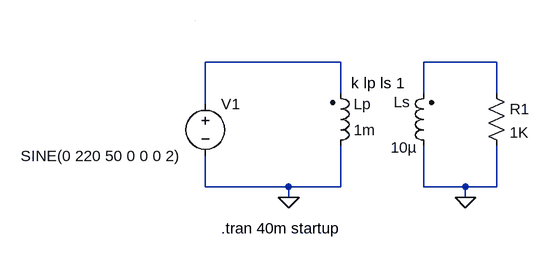
[diagram p0: schematic Transformer.asc]
Transformer.asc, the LTspice schematic file:
Version 4
SHEET 1 880 680
WIRE 224 64 16 64
WIRE 464 64 352 64
WIRE 224 112 224 64
WIRE 352 112 352 64
WIRE 464 112 464 64
WIRE 16 128 16 64
WIRE 16 256 16 208
WIRE 144 256 16 256
WIRE 224 256 224 192
WIRE 224 256 144 256
WIRE 352 256 352 192
WIRE 416 256 352 256
WIRE 464 256 464 192
WIRE 464 256 416 256
WIRE 144 272 144 256
WIRE 416 272 416 256
WIRE 0 0 0 0
FLAG 144 272 0
FLAG 416 272 0
SYMBOL voltage 16 112 R0
WINDOW 3 -284 96 Left 2
WINDOW 123 0 0 Left 0
WINDOW 39 0 0 Left 0
SYMATTR InstName V1
SYMATTR Value SINE(0 220 50 0 0 0 2)
SYMBOL res 448 96 R0
SYMATTR InstName R1
SYMATTR Value 1K
SYMBOL ind2 368 208 R180
WINDOW 0 37 83 Left 2
WINDOW 3 26 13 Left 2
SYMATTR InstName Ls
SYMATTR Value 10µ
SYMATTR Type ind
SYMATTR SpiceLine Rser=1m
SYMBOL ind2 208 208 M180
WINDOW 0 36 80 Left 2
WINDOW 3 36 40 Left 2
SYMATTR InstName Lp
SYMATTR Value 1m
SYMATTR Type ind
SYMATTR SpiceLine Rser=1m
TEXT 40 320 Left 2 !.tran 40m startup
TEXT 240 96 Left 2 !k lp ls 1

The netlist it stands for:
* Transformer.asc
V1 N001 0 SINE(0 220 50 0 0 0 2)
R1 N002 0 1K
Ls 0 N002 10µ Rser=1m
Lp 0 N001 1m Rser=1m
.tran 40m startup
k lp ls 1
.backanno
.end